# EAGLE design avr_lag1 (EAGLE 5.10)
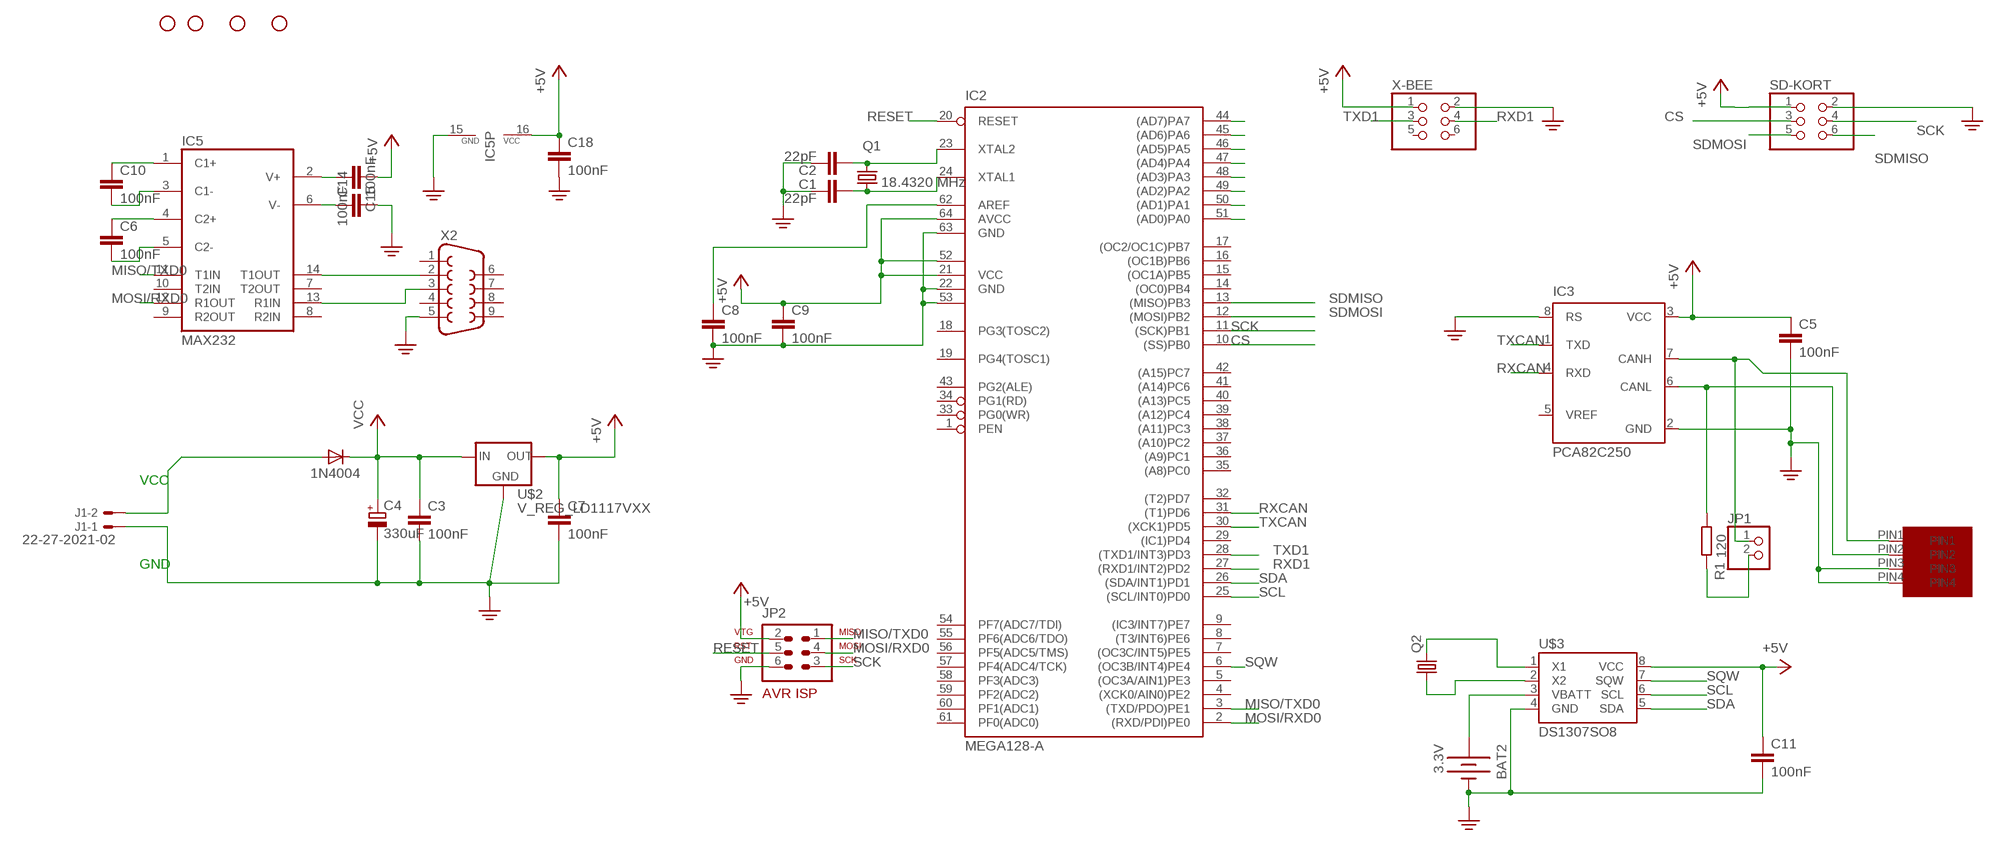
[diagram p0: schematic, sheet 1]

## Parts
BAT2  3.3V  BATTERY12PTH  [BATTCON_12MM_PTH]
C1  22pF  C5/2.5  [C5B2.5]
C2  22pF  C5/2.5  [C5B2.5]
C3  100nF  C-EU050-024X044  [C050-024X044]
C4  330uF  CPOL-EUE15-5AXIAL  [E15-5]
C5  100nF  C-EU050-024X044  [C050-024X044]
C6  100nF  C-EU050-024X044  [C050-024X044]
C7  100nF  C-EU050-024X044  [C050-024X044]
C8  100nF  C-EU050-024X044  [C050-024X044]
C9  100nF  C-EU050-024X044  [C050-024X044]
C10  100nF  C-EU050-024X044  [C050-024X044]
C11  100nF  C-EU050-024X044  [C050-024X044]
C14  100nF  C-EU050-024X044  [C050-024X044]
C15  100nF  C-EU050-024X044  [C050-024X044]
C18  100nF  C-EU050-024X044  [C050-024X044]
D1  1N4004  [DO41-10]
IC2  MEGA128-A  [TQFP64]
IC3  PCA82C250  [DIL08]
IC5  MAX232  [DIL16]
J1  22-27-2021-02  [6410-02]
JP1  PINHD-1X2  [1X02]
JP2  AVR-ISP-6  [AVR-ISP-6]
JP3  STAND-OFF  [STAND-OFF]
JP4  STAND-OFF  [STAND-OFF]
JP5  STAND-OFF  [STAND-OFF]
JP6  STAND-OFF  [STAND-OFF]
Q1  18.4320 MHz  CRYSTALHC49U70  [HC49U70]
Q2  CRYSTAL32-SMD  [CRYSTAL-32KHZ-SMD]
R1  120  R-EU_0207/10  [0207/10]
SD-KORT  PINHD-2X3  [2X03]
U$1  MICROFIT4  [MICROFIT4SOCK]
U$2  V_REG_LD1117VXX  [78XXL]
U$3  DS1307SO8  [SO08]
X2  DB9  [DB9]
X-BEE  PINHD-2X3  [2X03]

## Nets
+5V: C5.1 C7.1 C9.1 C11.1 C15.1 C18.1 IC2.21(VCC) IC2.52(VCC1) IC2.64(AVCC) IC3.3(VCC) IC5.16(VCC) JP2.2 SD-KORT.1 U$2.GND(OUT) U$3.8(VCC) X-BEE.1
CANJUMP1: IC3.7(CANH) JP1.1 U$1.PIN1
CANJUMP2: JP1.2 R1.2
CS: IC2.10((SS)PB0) SD-KORT.3
MISO/TXD0: IC2.3((TXD/PDO)PE1) IC5.11(T1IN) JP2.1
MOSI/RXD0: IC2.2((RXD/PDI)PE0) IC5.12(R1OUT) JP2.4
N$1: C1.2 IC2.24(XTAL1) Q1.1
N$2: C2.2 IC2.23(XTAL2) Q1.2
N$3: IC2.44((AD7)PA7)
N$4: IC2.45((AD6)PA6)
N$5: D1.A J1.2
N$6: IC2.46((AD5)PA5)
N$7: IC2.47((AD4)PA4)
N$8: BAT2.VCC@1(+) U$3.3(VBATT)
N$10: C8.1 IC2.62(AREF)
N$12: Q2.X2 U$3.1(X1)
N$13: Q2.X1 U$3.2(X2)
N$14: IC2.48((AD3)PA3)
N$15: IC2.49((AD2)PA2)
N$16: IC2.50((AD1)PA1)
N$17: IC2.51((AD0)PA0)
N$21: IC5.13(R1IN) X2.3
N$33: IC5.14(T1OUT) X2.2
N$35: C10.1 IC5.1(C1+)
N$36: C10.2 IC5.3(C1-)
N$37: C6.1 IC5.4(C2+)
N$38: C6.2 IC5.5(C2-)
N$39: C14.1 IC5.6(V-)
N$41: C15.2 IC5.2(V+)
N$51: IC3.6(CANL) R1.1 U$1.PIN2
PE: BAT2.GND(-) C1.1 C2.1 C3.2 C4.- C5.2 C7.2 C8.2 C9.2 C11.2 C14.2 C18.2 IC2.22(GND) IC2.53(GND1) IC2.63(GND) IC3.2(GND) IC3.8(RS) IC5.15(GND) J1.1 JP2.6 SD-KORT.2 U$1.PIN3 U$1.PIN4 U$2.IN(GND) U$3.4(GND) X2.5 X-BEE.2
RESET: IC2.20(RESET) JP2.5
RXCAN: IC2.31((T1)PD6) IC3.4(RXD)
RXD1: IC2.27((RXD1/INT2)PD2) X-BEE.4
SCK: IC2.11((SCK)PB1) JP2.3 SD-KORT.4
SCL: IC2.25((SCL/INT0)PD0) U$3.6(SCL)
SDA: IC2.26((SDA/INT1)PD1) U$3.5(SDA)
SDMISO: IC2.13((MISO)PB3) SD-KORT.6
SDMOSI: IC2.12((MOSI)PB2) SD-KORT.5
SQW: IC2.6((OC3B/INT4)PE4) U$3.7(SQW)
TXCAN: IC2.30((XCK1)PD5) IC3.1(TXD)
TXD1: IC2.28((TXD1/INT3)PD3) X-BEE.3
VCC: C3.1 C4.+ D1.C U$2.OUT(IN)
Unconnected: IC2.1(PEN) IC2.4((XCK0/AIN0)PE2) IC2.5((OC3A/AIN1)PE3) IC2.7((OC3C/INT5)PE5) IC2.8((T3/INT6)PE6) IC2.9((IC3/INT7)PE7) IC2.14((OC0)PB4) IC2.15((OC1A)PB5) IC2.16((OC1B)PB6) IC2.17((OC2/OC1C)PB7) IC2.18(PG3(TOSC2)) IC2.19(PG4(TOSC1)) IC2.29((IC1)PD4) IC2.32((T2)PD7) IC2.33(PG0(WR)) IC2.34(PG1(RD)) IC2.35((A8)PC0) IC2.36((A9)PC1) IC2.37((A10)PC2) IC2.38((A11)PC3) IC2.39((A12)PC4) IC2.40((A13)PC5) IC2.41((A14)PC6) IC2.42((A15)PC7) IC2.43(PG2(ALE)) IC2.54(PF7(ADC7/TDI)) IC2.55(PF6(ADC6/TDO)) IC2.56(PF5(ADC5/TMS)) IC2.57(PF4(ADC4/TCK)) IC2.58(PF3(ADC3)) IC2.59(PF2(ADC2)) IC2.60(PF1(ADC1)) IC2.61(PF0(ADC0)) IC3.5(VREF) IC5.7(T2OUT) IC5.8(R2IN) IC5.9(R2OUT) IC5.10(T2IN) X2.1 X2.4 X2.6 X2.7 X2.8 X2.9 X-BEE.5 X-BEE.6

## Notes on the sheet
- VCC
- GND

## Library data of the parts
BAT2 = SparkFun:BATTERY: Battery Holders Various common sizes : AA, AAA, 20mm coin cell and 12mm coin cell.
C1 C2 = capacitor-wima:C: CAPACITOR naming: grid - package width
C3 C5-C11 C14 C15 C18 = rcl:C-EU: CAPACITOR, European symbol
C4 = rcl:CPOL-EU: POLARIZED CAPACITOR, European symbol
D1 = diode:1N4004: DIODE general purpose rectifier, 1 A
IC2 = atmel:MEGA128: MICROCONTROLLER 128 Kbytes FLASH 4 Kbytes SRAM 4 Kbytes EEPROM DUAL USART 8-channel 10 bit ADC Source: avr.lbr
IC3 = micro-philips:PCA82C250: CAN CONTROLLER INTERFACE
IC5 = maxim:MAX232: RS232 TRANSEIVER
J1 = con-molex:22-?-02: CONNECTOR wire to board 2.54 mm (.1 inch) pitch header
JP1 = pinhead:PINHD-1X2: PIN HEADER
JP2 = avr-5:AVR-ISP-6: AVR ISP-6 Serial Programming Header
JP3-JP6 = SparkFun:STAND-OFF: Stand Off This is the mechanical footprint for a #4 phillips button head screw. Use the keepout ring to avoid running the screw head into surrounding components. SKU : PRT-00447
Q1 = crystal:CRYSTAL: CRYSTAL
Q2 = SparkFun:CRYSTAL: Crystals Various standard crystals. Proven footprints. Spark Fun Electronics SKU : COM-00534
R1 = resistor:R-EU_: RESISTOR, European symbol
SD-KORT X-BEE = pinhead:PINHD-2X3: PIN HEADER
U$1 = UNICORN:MICROFIT4
U$2 = SparkFun:V_REG_LD1117VXX: LD1117VXX voltage regulator. We carry the 3.3V version (COM-00526) in TO-220 package.
U$3 = SparkFun:DS1307
X2 = SparkFun:DB9: DB9 Connector Standard DB9 (D-Sub 9) serial connector. Can be used for CAN bus as well as RS485 and RS232. Footprint production proven. Spark Fun Electronics SKU : PRT-00429

## Board
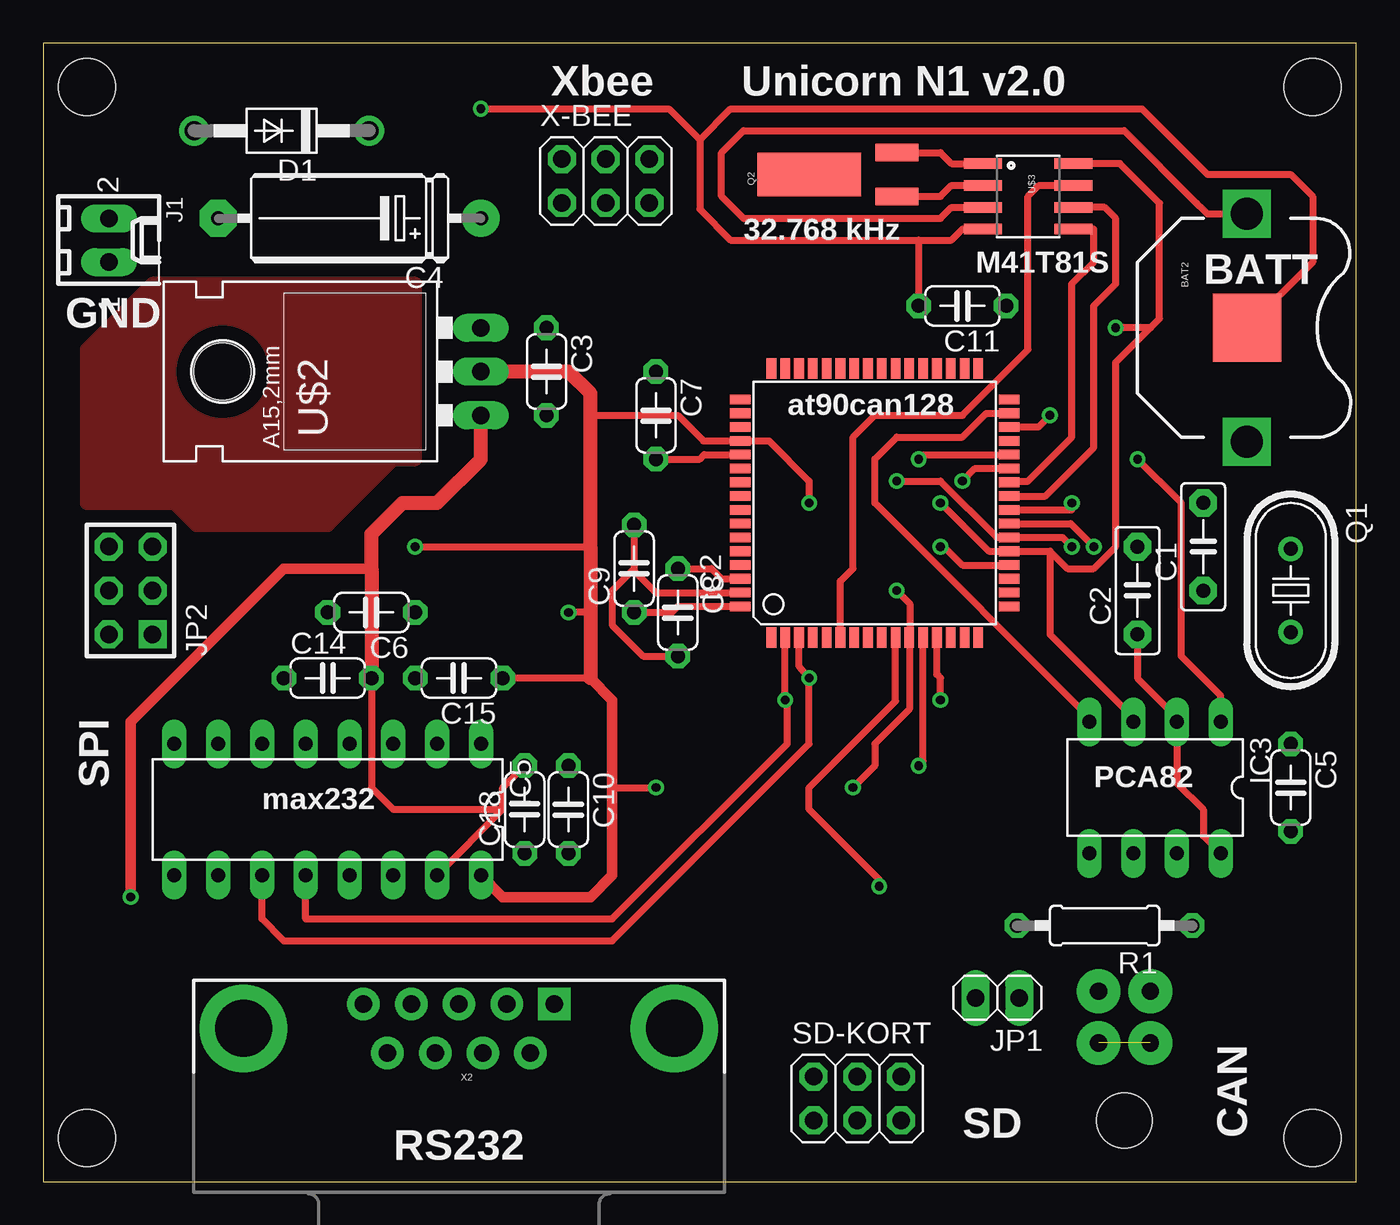
[diagram p1: board, top side]
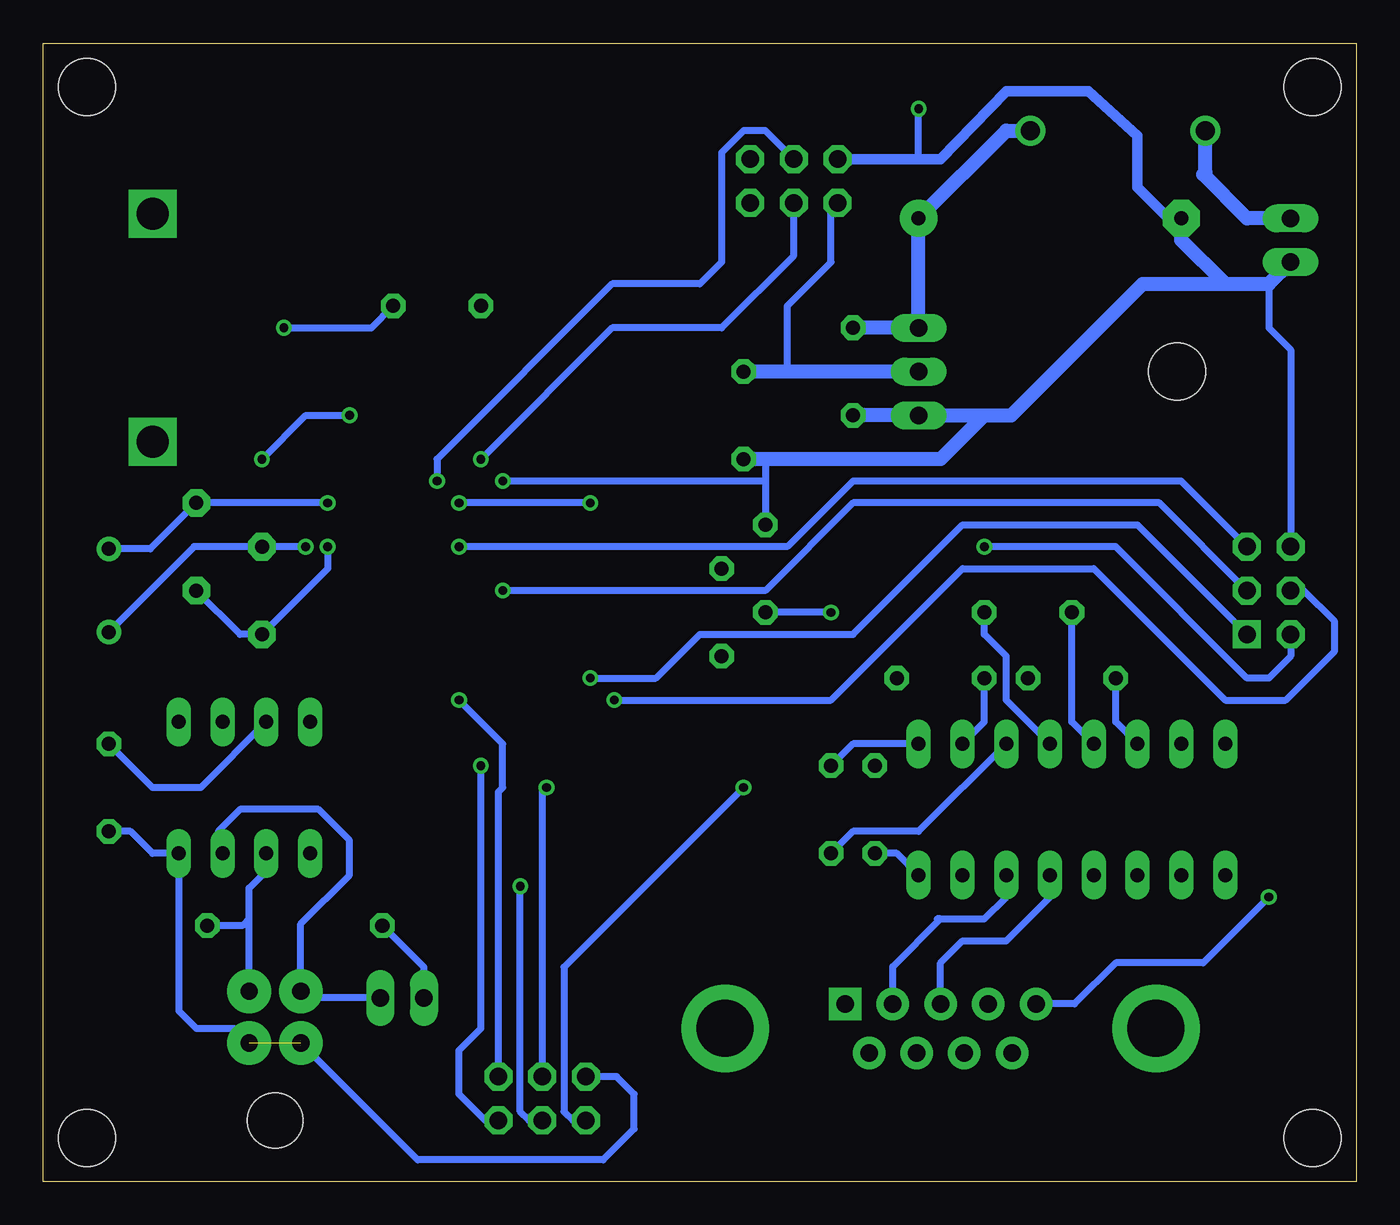
[diagram p2: board, bottom side, seen from below]

Size 76.2 x 66.04 mm. Coordinates in mm from the lower left corner, seen from the top.
Outline: 0,0 76.2,0 76.2,66.04 0,66.04 0,0
Copper layers (1*16): Top 0.035mm / dielectric 1.5mm / Bottom 0.035mm
Design rules "default *": minimum track width 12mil, minimum drill 24mil, track to track 12mil, track to pad 12mil, pad to pad 8mil, via to via 8mil, smd to smd 8mil, copper to edge 40mil, drill to drill 8mil, minimum pad ring 12mil, minimum via ring 8mil, stop-mask expansion 4mil, vias tented up to drill 0mil, thermal gap 10mil

### Footprints (pad centres in the part's own frame; a part is rotated, then mirrored left to right if it is on the bottom)
BATTCON_12MM_PTH = smd 3.962 x 3.962: GND 0,0 | drill 1.854 square: VCC@1 -6.604,0; VCC@2 6.604,0
C5B2.5 = drill 0.813 pad 1.6 octagon: 1 -2.54,0; 2 2.54,0
C050-024X044 = drill 0.813 octagon: 1 -2.54,0; 2 2.54,0
E15-5 = drill 0.813 pad 2.159 round: + -7.62,0 | drill 0.813 pad 2.159 octagon: - 7.62,0
DO41-10 = drill 1.118 round: A 5.08,0; C -5.08,0
TQFP64 = smd 1.194 x 0.559: 1 -7.8,6; 2 -7.8,5.2; 3 -7.8,4.4; 4 -7.8,3.6; 5 -7.8,2.8; 6 -7.8,2; 7 -7.8,1.2; 8 -7.8,0.4; 9 -7.8,-0.4; 10 -7.8,-1.2; 11 -7.8,-2; 12 -7.8,-2.8; 13 -7.8,-3.6; 14 -7.8,-4.4; 15 -7.8,-5.2; 16 -7.8,-6; 33 7.8,-6; 34 7.8,-5.2; 35 7.8,-4.4; 36 7.8,-3.6; 37 7.8,-2.8; 38 7.8,-2; 39 7.8,-1.2; 40 7.8,-0.4; 41 7.8,0.4; 42 7.8,1.2; 43 7.8,2; 44 7.8,2.8; 45 7.8,3.6; 46 7.8,4.4; 47 7.8,5.2; 48 7.8,6 | smd 0.559 x 1.194: 17 -6,-7.8; 18 -5.2,-7.8; 19 -4.4,-7.8; 20 -3.6,-7.8; 21 -2.8,-7.8; 22 -2,-7.8; 23 -1.2,-7.8; 24 -0.4,-7.8; 25 0.4,-7.8; 26 1.2,-7.8; 27 2,-7.8; 28 2.8,-7.8; 29 3.6,-7.8; 30 4.4,-7.8; 31 5.2,-7.8; 32 6,-7.8; 49 6,7.8; 50 5.2,7.8; 51 4.4,7.8; 52 3.6,7.8; 53 2.8,7.8; 54 2,7.8; 55 1.2,7.8; 56 0.4,7.8; 57 -0.4,7.8; 58 -1.2,7.8; 59 -2,7.8; 60 -2.8,7.8; 61 -3.6,7.8; 62 -4.4,7.8; 63 -5.2,7.8; 64 -6,7.8
DIL08 = drill 0.813 long: 1 -3.81,-3.81; 2 -1.27,-3.81; 3 1.27,-3.81; 4 3.81,-3.81; 5 3.81,3.81; 6 1.27,3.81; 7 -1.27,3.81; 8 -3.81,3.81
DIL16 = drill 0.813 long: 1 -8.89,-3.81; 2 -6.35,-3.81; 3 -3.81,-3.81; 4 -1.27,-3.81; 5 1.27,-3.81; 6 3.81,-3.81; 7 6.35,-3.81; 8 8.89,-3.81; 9 8.89,3.81; 10 6.35,3.81; 11 3.81,3.81; 12 1.27,3.81; 13 -1.27,3.81; 14 -3.81,3.81; 15 -6.35,3.81; 16 -8.89,3.81
6410-02 = drill 1.016 long: 1 1.27,0; 2 -1.27,0
1X02 = drill 1.016 long: 1 -1.27,0; 2 1.27,0
AVR-ISP-6 = drill 1.016 square: 1 -2.54,-1.27 | drill 1.016 octagon: 2 -2.54,1.27; 3 0,-1.27; 4 0,1.27; 5 2.54,-1.27; 6 2.54,1.27
STAND-OFF = hole 3.302: 0,0
HC49U70 = drill 0.813 round: 1 -2.413,0; 2 2.413,0
CRYSTAL-32KHZ-SMD = smd 2.5 x 6: SHEILD 0,5.08 | smd 1 x 2.5: X1 -1.27,0; X2 1.27,0
0207/10 = drill 0.813 octagon: 1 -5.08,0; 2 5.08,0
2X03 = drill 1.016 octagon: 1 -2.54,-1.27; 2 -2.54,1.27; 3 0,-1.27; 4 0,1.27; 5 2.54,-1.27; 6 2.54,1.27
MICROFIT4SOCK = drill 1 pad 2.54 round: PIN1 -2,0; PIN2 1,0; PIN3 -2,-3; PIN4 1,-3 | hole 3.2: -0.5,-7.5
78XXL = drill 1.016 long: GND 0,-3.81; IN -2.54,-3.81; OUT 2.54,-3.81 | hole 3.302: 0,11.176
SO08 = smd 0.61 x 2.21: 1 -1.905,-2.616; 2 -0.635,-2.616; 3 0.635,-2.616; 4 1.905,-2.616; 5 1.905,2.616; 6 0.635,2.616; 7 -0.635,2.616; 8 -1.905,2.616
DB9 = drill 1.016 pad 1.88 square: 1 -5.54,-1.42 | drill 1.016 pad 1.88 round: 2 -2.77,-1.42; 3 0,-1.42; 4 2.77,-1.42; 5 5.54,-1.42; 6 -4.15,1.42; 7 -1.38,1.42; 8 1.38,1.42; 9 4.15,1.42 | drill 3.302 pad 5.08 round: G1 -12.5,0; G2 12.5,0

### Placement (x,y rotation side)
BAT2  69.85,49.53 270 top
C1  67.31,36.83 90 top
C2  63.5,34.29 90 top
C3  29.21,46.99 270 top
C4  17.78,55.88 180 top
C5  72.39,22.86 270 top
C6  19.05,33.02 180 top
C7  35.56,44.45 270 top
C8  36.83,33.02 270 top
C9  34.29,35.56 90 top
C10  30.48,21.59 270 top
C11  53.34,50.8 180 top
C14  16.51,29.21 0 top
C15  24.13,29.21 180 top
C18  27.94,21.59 90 top
D1  13.84,60.96 180 top
IC2  48.26,39.37 90 top
IC3  64.52,22.86 180 top
IC5  16.51,21.59 180 top
J1  3.81,54.61 270 top
JP1  55.37,10.67 180 top
JP2  5.08,34.29 90 top
JP3  2.54,2.54 0 top
JP4  73.66,2.54 0 top
JP5  2.54,63.5 0 top
JP6  73.66,63.5 0 top
Q1  72.39,34.29 270 top
Q2  49.53,58.42 90 top
R1  61.59,14.86 180 top
SD-KORT  47.24,4.83 0 top
U$1  63.25,11.05 0 top
U$2  21.59,46.99 90 top
U$3  57.15,57.15 270 top
X2  24.13,8.89 180 top
X-BEE  32.64,58.04 0 top

### Tracks (layer width: path | path; a pad name or v marks a point on that pad's centre or on a via)
+5V  (via drill 0.51)
  Top 0.406: U$3.8 62.48,59.05 64.77,56.77 64.77,50.06 64.24,49.53 | 58.42,36.57 IC2.21 54.87,36.57 v52.07,39.37 | 58.42,36.57 59.43,35.56 60.96,35.56 62.23,36.83 62.23,47.52 64.24,49.53 | 31.75,43.18 31.75,42.97 | 31.75,44.45 36.83,44.45 38.31,42.97 IC2.52 42.12,42.97 44.45,40.64 v44.45,39.37 | IC2.64 36.83,33.37 36.48,33.02 C9.1 | 31.75,33.02 v30.48,33.02 | 64.24,49.53 v62.23,49.53 | v21.59,36.83 31.75,36.83 | 31.75,29.21 C15.1 | IC3.3 63.25,26.92 58.42,31.75 58.42,36.57 | 33.02,22.86 v35.56,22.86
  Top 0.61: IC5.16 26.67,16.51 31.75,16.51 33.02,17.78 33.02,22.86 33.02,27.94 31.75,29.21
  Top 0.813: 31.75,29.21 31.75,33.02 31.75,36.83 31.75,43.18 31.75,44.45 31.75,45.72 30.48,46.99 U$2.GND
  Bottom 0.406: v30.48,33.02 C9.1 | 33.02,46.99 33.02,50.8 30.48,53.34 30.48,56.39 X-BEE.1 | JP2.2 3.81,30.48 5.08,29.21 6.35,29.21 13.97,36.83 v21.59,36.83 | C18.1 26.67,19.05 IC5.16 | v44.45,39.37 v52.07,39.37 | C5.1 69.85,22.86 67.06,22.86 IC3.3 | SD-KORT.1 45.47,3.56 45.97,4.06 45.97,12.45 v35.56,22.86 | v62.23,49.53 57.15,49.53 C11.1
  Bottom 0.813: U$2.GND 33.02,46.99 C7.1
CANJUMP1
  Bottom 0.406: IC3.7 66.04,19.3 66.04,20.32 64.77,21.59 60.22,21.59 58.42,19.79 58.42,17.78 61.25,14.95 U$1.PIN1 60.87,10.67 JP1.1
CANJUMP2
  Bottom 0.406: JP1.2 54.1,12.45 R1.2
CS  (via drill 0.51)
  Top 0.406: v48.51,17.14 48.51,17.53 44.45,21.59 44.45,22.86 49.46,27.87 IC2.10
  Bottom 0.406: SD-KORT.3 48.01,3.56 48.51,4.06 v48.51,17.14
MISO/TXD0  (via drill 0.51)
  Top 0.406: IC2.3 43.86,29.89 v44.45,29.21 44.45,25.4 33.02,13.97 13.97,13.97 12.7,15.24 IC5.11
  Bottom 0.406: v44.45,29.21 40.64,29.21 38.1,31.75 29.21,31.75 22.86,38.1 12.7,38.1 JP2.1
MOSI/RXD0  (via drill 0.51)
  Top 0.406: IC2.2 v43.05,27.94 43.18,27.81 43.18,25.4 33.02,15.24 15.24,15.24 IC5.12
  Bottom 0.406: JP2.4 3.07,34.29 1.27,32.49 1.27,30.78 4.11,27.94 7.62,27.94 15.24,35.56 22.86,35.56 30.48,27.94 v43.05,27.94
N$1  (via drill 0.51)
  Top 0.406: IC2.24 59.69,38.97 v59.69,39.37
  Bottom 0.406: v59.69,39.37 C1.2 69.98,36.7 Q1.1
N$2  (via drill 0.51)
  Top 0.406: IC2.23 59.62,38.17 v60.96,36.83
  Bottom 0.406: Q1.2 67.44,36.83 C2.2 v60.96,36.83
N$5
  Bottom 0.813: D1.A 8.76,58.55 8.89,58.42 6.35,55.88 J1.2
N$8
  Top 0.406: U$3.3 52.7,56.52 52.07,55.88 40.64,55.88 39.37,57.15 39.37,59.69 40.64,60.96 62.73,60.96 66.92,56.77 67.31,56.38 67.56,56.13 BAT2.VCC@1
N$9
  pour Top: 21.59,52.07 6.35,52.07 2.54,48.26 2.54,39.37 7.62,39.37 8.89,38.1 16.51,38.1 20.32,41.91 21.59,41.91
N$10
  Top 0.406: IC2.62 39.37,34.97 38.78,35.56 C8.1
N$12
  Top 0.406: U$3.1 52.7,59.05 52.07,59.69 Q2.X2
N$13
  Top 0.406: U$3.2 52.7,57.78 52.07,57.15 Q2.X1
N$21
  Bottom 0.406: IC5.13 17.78,16.51 20.32,13.97 22.86,13.97 24.13,12.7 X2.3
N$33
  Bottom 0.406: IC5.14 20.32,16.51 21.59,15.24 24.13,15.24 | 24.13,15.24 24.33,15.24 | X2.2 26.9,12.47 24.13,15.24
N$35
  Bottom 0.406: IC5.1 29.21,25.4 C10.1
N$36
  Bottom 0.406: C10.2 29.21,20.32 25.4,20.32 IC5.3
N$37
  Bottom 0.406: C6.1 21.59,31.75 20.32,30.48 20.32,27.94 IC5.4
N$38
  Bottom 0.406: C6.2 16.51,26.67 IC5.5
N$39
  Bottom 0.406: C14.1 13.97,26.67 IC5.6
N$41
  Bottom 0.406: C15.2 21.59,26.67 IC5.2
N$51
  Bottom 0.406: U$1.PIN2 64.25,15.24 | 64.25,15.24 64.25,17.03 63.5,17.78 63.5,18.8 IC3.6 | R1.1 64.63,14.86 64.25,15.24
PE  (via drill 0.51)  (1 unrouted)
  Top 0.406: U$3.4 53.34,55.24 52.7,54.61 50.8,54.61 | 50.8,54.61 39.9,54.61 38.1,56.41 38.1,60.43 | 38.1,60.43 39.9,62.23 63.75,62.23 67.56,58.42 72.39,58.42 73.66,57.15 73.66,53.34 BAT2.GND | v59.69,36.83 59.15,37.37 IC2.22 55.34,37.37 52.07,40.64 v49.53,40.64 | IC2.53 38.36,42.17 38.1,41.91 C7.2 | IC2.63 35.57,34.17 34.29,35.45 34.29,35.56 | C9.2 34.29,35.56 | C8.2 34.82,30.48 33.02,32.28 33.02,34.29 34.29,35.56 | v25.4,62.23 36.3,62.23 38.1,60.43 | 26.67,21.59 26.67,22.86 C18.2 | 26.67,21.59 IC5.15 | C14.2 19.05,22.86 20.32,21.59 26.67,21.59 | C2.1 63.5,29.21 65.79,26.92 IC3.2 65.79,23.11 67.31,21.59 67.31,20.07 IC3.8 | 50.8,54.61 C11.2
  Top 0.61: 19.05,35.56 13.97,35.56 5.08,26.67 v5.08,16.51
  Top 0.813: C14.2 19.05,35.56 19.05,37.57 20.85,39.37 22.86,39.37 25.4,41.91 U$2.IN
  Bottom 0.406: C1.1 64.77,31.75 C2.1 59.69,35.56 v59.69,36.83 | JP2.6 3.81,48.26 5.08,49.53 5.08,52.07 | 34.29,41.91 34.29,40.64 | 34.29,40.64 C9.2 | 25.4,59.31 v25.4,62.23 | C5.2 71.12,20.32 69.85,19.05 IC3.8 68.33,9.91 67.31,8.89 65.09,8.89 U$1.PIN4 | SD-KORT.2 42.93,6.1 41.91,5.08 41.91,3.07 43.71,1.27 54.47,1.27 U$1.PIN3 | 34.29,40.64 v49.53,40.64 | X2.5 16.36,10.31 13.97,12.7 8.89,12.7 v5.08,16.51
  Bottom 0.61: X-BEE.2 25.4,59.31 24.13,59.31 20.32,63.25 15.54,63.25 12.7,60.66 12.7,57.68 10.9,55.88 C4.-
  Bottom 0.813: 7.62,52.07 5.08,52.07 J1.1 | 21.59,44.45 U$2.IN C3.2 | 21.59,44.45 24.13,41.91 34.29,41.91 C7.2 | C4.- 10.16,54.61 7.62,52.07 | 21.59,44.45 20.02,44.45 12.4,52.07 7.62,52.07
RESET  (via drill 0.51)
  Top 0.406: v52.07,36.83 52.28,36.83 53.34,35.77 IC2.20
  Bottom 0.406: JP2.5 10.16,40.64 29.21,40.64 33.02,36.83 v52.07,36.83
RXCAN
  Top 0.406: IC3.4 60.71,26.92 48.26,39.37 48.26,41.91 49.53,43.18 53.34,43.18 54.73,44.57 IC2.31
RXD1  (via drill 0.51)
  Top 0.406: IC2.27 54.07,41.37 v53.34,40.64
  Bottom 0.406: v53.34,40.64 53.34,41.91 43.18,52.07 38.1,52.07 36.83,53.34 36.83,59.69 35.56,60.96 34.29,60.96 X-BEE.4
SCK  (via drill 0.51)
  Top 0.406: v49.53,34.29 50.29,33.53 50.29,31.57 IC2.11 50.26,27.4 48.26,25.4 48.26,24.13 v46.99,22.86
  Bottom 0.406: JP2.3 11.43,39.37 29.21,39.37 34.29,34.29 v49.53,34.29 | SD-KORT.4 47.24,22.61 v46.99,22.86
SCL
  Top 0.406: U$3.6 61.59,56.52 62.23,55.88 62.23,52.07 60.96,50.8 60.96,42.58 58.15,39.77 IC2.25
SDA
  Top 0.406: U$3.5 60.96,55.24 60.96,53.34 59.69,52.07 59.69,43.18 57.15,40.64 56.06,40.64 IC2.26
SDMISO  (via drill 0.51)
  Top 0.406: v52.07,27.94 52.07,29.21 51.86,29.42 IC2.13
  Bottom 0.406: SD-KORT.6 49.78,22.61 49.53,22.86 49.53,25.4 v52.07,27.94
SDMOSI  (via drill 0.51)
  Top 0.406: IC2.12 51.06,24.39 v50.8,24.13
  Bottom 0.406: SD-KORT.5 50.55,3.56 52.07,5.08 52.07,7.62 50.8,8.89 v50.8,24.13
SQW
  Top 0.406: U$3.7 57.78,57.78 57.15,57.15 57.15,48.26 53.34,44.45 48.26,44.45 46.99,43.18 46.99,35.56 46.26,34.83 IC2.6
TXCAN  (via drill 0.51)
  Top 0.406: IC3.1 68.33,28.19 66.04,30.48 66.04,39.37 v63.5,41.91 | IC2.30 57.74,43.77 v58.42,44.45
  Bottom 0.406: v58.42,44.45 60.96,44.45 v63.5,41.91
TXD1  (via drill 0.51)
  Top 0.406: IC2.28 50.8,42.17 v50.8,41.91
  Bottom 0.406: v50.8,41.91 43.18,49.53 36.83,49.53 32.64,53.72 X-BEE.3
VCC
  Bottom 0.813: C3.1 U$2.OUT C4.+ 20.32,60.96 D1.C

### Text on the board
tPlace: Xbee | Unicorn N1 v2.0 | 32.768 kHz | M41T81S | BATT | GND | at90can128 | SPI | PCA82 | max232 | SD | CAN | RS232